# Altium schematic sheet ESP32_Module.SchDoc
size A; SheetNumber: 2; SheetTotal: 4
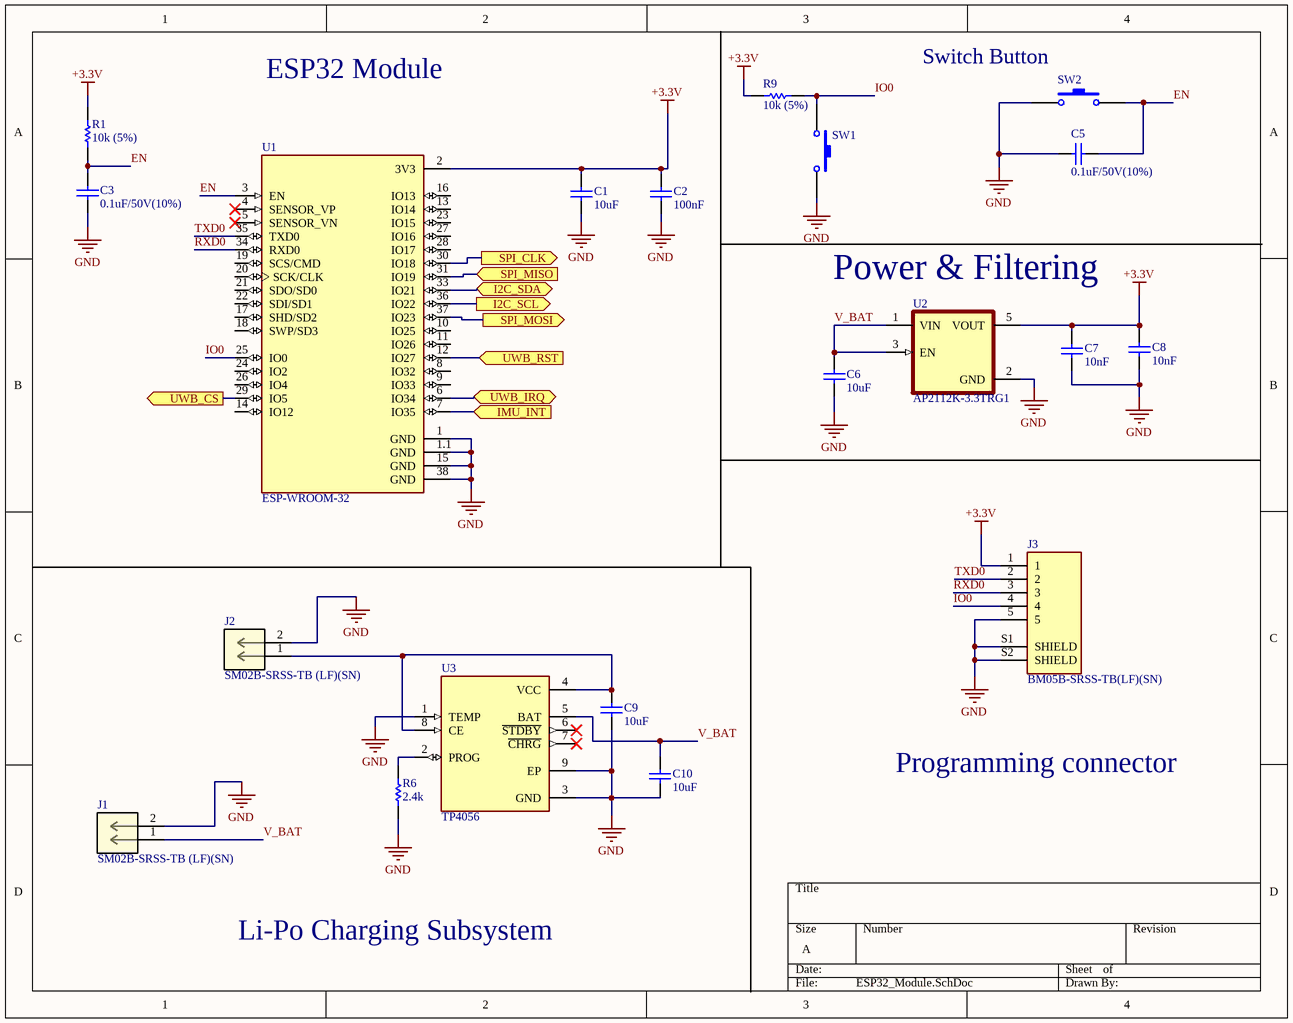
[diagram p0: ESP32_Module.SchDoc]

## Parts
C1  value 10uF  [CAPC1608X90]  (hidden comment: Cap)
C2  value 100nF  [CAPC1005X55N]  (hidden comment: Cap)
C3  value 0.1uF/50V(10%)  [CAPC2012X94N]  (hidden comment: Cap)
C5  value 0.1uF/50V(10%)  [CAPC2012X94N]  (hidden comment: Cap)
C6  value 10uF  [CAPC1608X90]  (hidden comment: Cap)
C7  value 10nF  [CAPC1608X87N]  (hidden comment: Cap)
C8  value 10nF  [CAPC1608X87N]  (hidden comment: Cap)
C9  value 10uF  [CAPC1608X90]  (hidden comment: Cap)
C10  value 10uF  [CAPC1608X90]  (hidden comment: Cap)
J1  SM02B-SRSS-TB (LF)(SN)  [CONN_SM02B-SRSS-TB_JST]
J2  SM02B-SRSS-TB (LF)(SN)  [CONN_SM02B-SRSS-TB_JST]
J3  BM05B-SRSS-TB(LF)(SN)  [JST_BM05B-SRSS-TB(LF)(SN)]
R1  value 10k (5%)  [RESC1005X40]  (hidden comment: Res1)
R6  value 2.4k  [RESC1005X40N]  (hidden comment: Res1)
R9  value 10k (5%)  [RESC1005X40]  (hidden comment: Res1)
SW1  SW-PB  [SW_TL3342F160QG]  (value not drawn)
SW2  SW-PB  [SW_TL3342F160QG]  (value not drawn)
U1  ESP-WROOM-32  [MODULE_ESP-WROOM-32]
U2  AP2112K-3.3TRG1  [SOT95P285X140-5N]
U3  TP4056  [SOP127P600X175-9N]

## Ports
I2C_SCL (out), I2C_SDA (bidir), IMU_INT (in), SPI_CLK (out), SPI_MISO (in), SPI_MOSI (out), UWB_CS (out), UWB_IRQ (bidir), UWB_RST (in)

## Nets
+3.3V: C1.2 C2.2 C7.2 C8.2 J3.1 R1.2 R9.2 U1.2(3V3) U2.5(VOUT)
GND: C1.1 C2.1 C3.1 C5.1 C6.1 C7.1 C8.1 C9.1 C10.1 J1.2 J2.2 J3.5 J3.S1(SHIELD) J3.S2(SHIELD) R6.1 SW1.2 SW2.1 U1.1(GND) U1.1.1(GND) U1.15(GND) U1.38(GND) U2.2(GND) U3.1(TEMP) U3.3(GND) U3.9(EP)
EN: C3.2 C5.2 R1.1 SW2.2 U1.3(EN)
I2C_SCL: U1.36(IO22) ; port I2C_SCL
I2C_SDA: U1.33(IO21) ; port I2C_SDA
IMU_INT: U1.7(IO35) ; port IMU_INT
IO0: J3.4 R9.1 SW1.1 U1.25(IO0)
RXD0: J3.3 U1.34(RXD0)
SPI_CLK: U1.30(IO18) ; port SPI_CLK
SPI_MISO: U1.31(IO19) ; port SPI_MISO
SPI_MOSI: U1.37(IO23) ; port SPI_MOSI
TXD0: J3.2 U1.35(TXD0)
UWB_CS: U1.29(IO5) ; port UWB_CS
UWB_IRQ: U1.6(IO34) ; port UWB_IRQ
UWB_RST: U1.12(IO27) ; port UWB_RST
V_BAT: C6.2 C10.2 J1.1 U2.1(VIN) U2.3(EN) U3.5(BAT)
NetC9_2: C9.2 J2.1 U3.4(VCC) U3.8(CE)
NetR6_2: R6.2 U3.2(PROG)

Not connected (* = marked no-connect by the designer): U1 4(SENSOR_VP)* 5(SENSOR_VN)* 8(IO32) 9(IO33) 10(IO25) 11(IO26) 13(IO14) 14(IO12) 16(IO13) 17(SHD/SD2) 18(SWP/SD3) 19(SCS/CMD) 20(SCK/CLK) 21(SDO/SD0) 22(SDI/SD1) 23(IO15) 24(IO2) 26(IO4) 27(IO16) 28(IO17); U3 6(~{STDBY})* 7(~{CHRG})*

## Notes on the sheet
- ESP32 Module
- (near SW2) Switch Button
- Power & Filtering
- Programming connector
- Li-Po Charging Subsystem

## Library data of the parts
C1-C3 C5-C10 = Cap: Capacitor; Published: 8-Jun-2000; LatestRevisionDate: 17-Jul-2002; LatestRevisionNote: Re-released for DXP Platform.; PackageReference: RAD-0.3; Publisher: Altium Limited; PackageDescription: Radial Cap, Thru-Hole; 2 Leads; 0.3 in Pin Spacing
J1 J2 = SM02B-SRSS-TB LFSN: Description; Manufacturer_Name: JST; Copyright: Copyright (C) 2026 Ultra Librarian. All rights reserved.; Manufacturer_Part_Number: SM02B-SRSS-TB (LF)(SN); RefDes: RefDes; Type: Type
R1 R6 R9 = Res1: Resistor; Published: 8-Jun-2000; LatestRevisionDate: 17-Jul-2002; LatestRevisionNote: Re-released for DXP Platform.; PackageReference: AXIAL-0.3; Publisher: Altium Limited; PackageDescription: Axial Device, Thru-Hole; 2 Leads; 0.3 in Pin Spacing
SW1 SW2 = SW-PB: Switch; Published: 24-Mar-1999; LatestRevisionDate: 17-Jul-2002; LatestRevisionNote: Re-released for DXP Platform.; PackageReference: SPST-2; Publisher: Altium Limited; PackageDescription: Switch; 2 Leads
U1 = ESP-WROOM-32: Transceptor serie ESP-WROOM-32; Placa de evaluaciÃ³n 802.11 b/g/n (Wi-Fi, WiFi, WLAN), BluetoothÂ® Smart 4.x de bajo consumo (BLE); MF: Espressif Systems; SnapEDA_Link: https://www.snapeda.com/parts/ESP-WROOM-32/Espressif+Systems/view-part/?ref=snap; Package: Module Espressif Systems; Value: *; MP: ESP-WROOM-32; Check_prices: https://www.snapeda.com/parts/ESP-WROOM-32/Espressif+Systems/view-part/?ref=eda
U2 = AP2112K-3.3TRG1: Linear Voltage Regulator IC Positive Fixed 1 Output 600mA SOT-25; MF: Diodes Inc.; Value: *; Purchase-URL: https://pricing.snapeda.com/search/part/AP2112K-3.3TRG1/?ref=eda; Package: SOT-753 Diodes Inc.; Availability: In Stock; Check_prices: https://www.snapeda.com/parts/AP2112K-3.3TRG1/Diodes+Inc./view-part/?ref=eda; Price: None; SnapEDA_Link: https://www.snapeda.com/parts/AP2112K-3.3TRG1/Diodes+Inc./view-part/?ref=snap; MP: AP2112K-3.3TRG1
U3 = TP4056: Complete single cell Li-Ion battery with a constant current / constant voltage linear charger; MF: NanJing Top Power ASIC Corp.; Check_prices: https://www.snapeda.com/parts/TP4056/NanJing+Top+Power+ASIC+Corp./view-part/?ref=eda; SnapEDA_Link: https://www.snapeda.com/parts/TP4056/NanJing+Top+Power+ASIC+Corp./view-part/?ref=snap; Price: None; Availability: Not in stock; Package: Package; MP: TP4056; Value: *
J3 = BM05B-SRSS-TB(LF)(SN): Package: None; Price: None; Value: *; MP: BM05B-SRSS-TB(LF)(SN); Availability: Unavailable